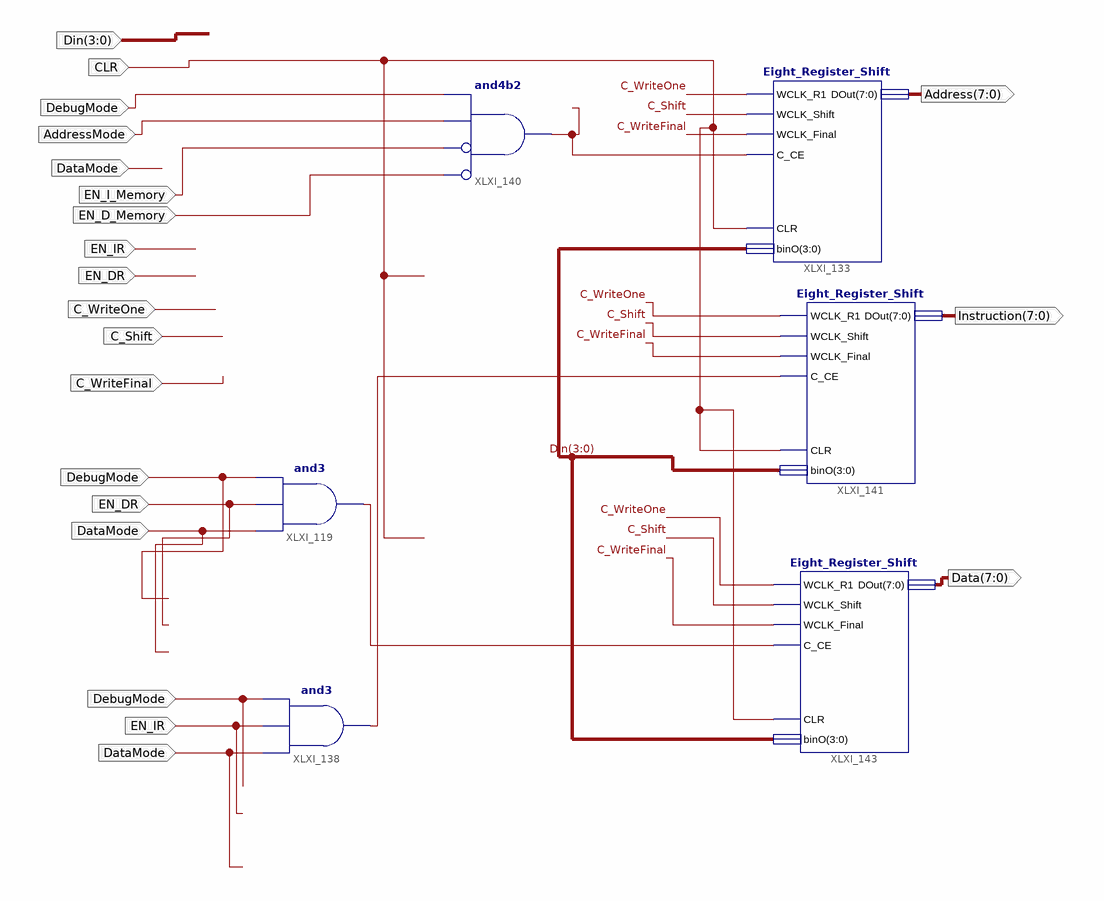
[diagram p0: schematic sheet 1]
// Xilinx ISE schematic Registers.sch (spartan3e) as structural Verilog: 6 symbols, 15 ports
module Registers (
  input  CLR,
  input  DebugMode,
  input  AddressMode,
  input  EN_IR,
  input  EN_DR,
  input  EN_D_Memory,
  input  DataMode,
  input  [3:0] Din,
  input  C_WriteFinal,
  input  C_WriteOne,
  input  C_Shift,
  input  EN_I_Memory,
  output [7:0] Address,
  output [7:0] Instruction,
  output [7:0] Data
);

  wire XLXN_45, XLXN_46, XLXN_49;

  Eight_Register_Shift XLXI_133 (
    .WCLK_Shift(C_Shift), .C_CE(XLXN_49), .WCLK_R1(C_WriteOne), .CLR(CLR), .WCLK_Final(C_WriteFinal),
    .DOut(Address), .binO(Din));
  and XLXI_119 (XLXN_45, DataMode, EN_DR, DebugMode);
  and XLXI_138 (XLXN_46, DataMode, EN_IR, DebugMode);
  and XLXI_140 (XLXN_49, ~EN_D_Memory, ~EN_I_Memory, AddressMode, DebugMode);  // and4b2
  Eight_Register_Shift XLXI_141 (
    .WCLK_Shift(C_Shift), .C_CE(XLXN_46), .WCLK_R1(C_WriteOne), .CLR(CLR), .WCLK_Final(C_WriteFinal),
    .DOut(Instruction), .binO(Din));
  Eight_Register_Shift XLXI_143 (
    .WCLK_Shift(C_Shift), .C_CE(XLXN_45), .WCLK_R1(C_WriteOne), .CLR(CLR), .WCLK_Final(C_WriteFinal),
    .DOut(Data), .binO(Din));
endmodule
